# Altium schematic sheet Resolver.SchDoc
size C
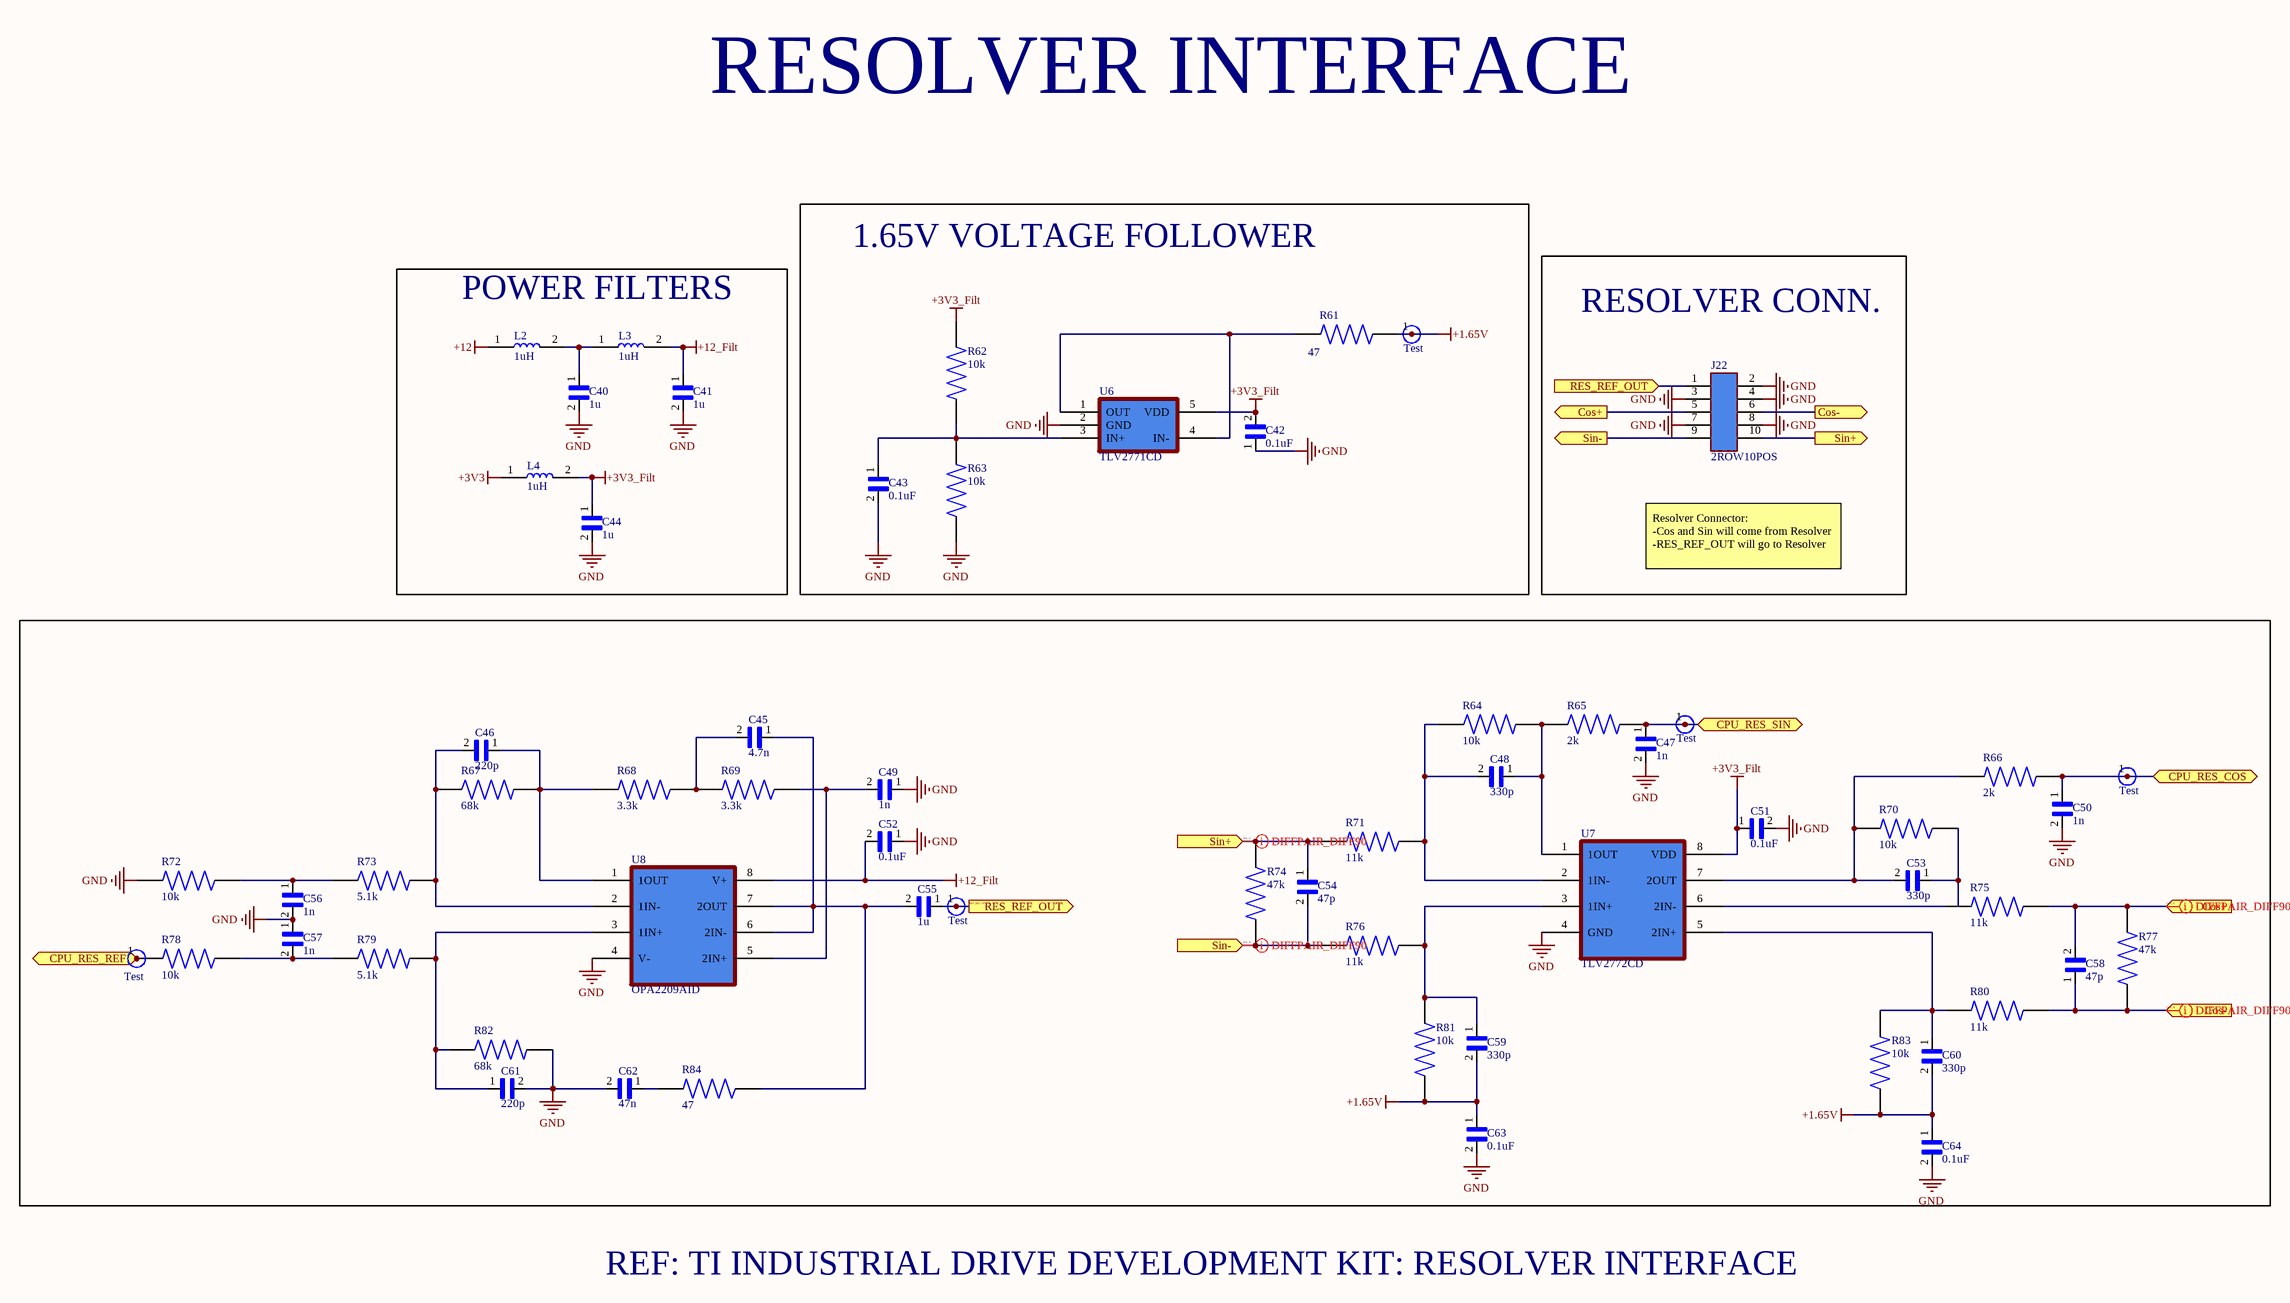
[diagram p0: Resolver.SchDoc]

## Parts
5  Test  [TestPoint]
6  Test  [TestPoint]
7  Test  [TestPoint]
8  Test  [TestPoint]
9  Test  [TestPoint]
C40  1u  [CAP 0805(2012 metric)]
C41  1u  [CAP 0805(2012 metric)]
C42  0.1uF  [CAP 0805(2012 metric)]
C43  0.1uF  [CAP 0805(2012 metric)]
C44  1u  [CAP 0805(2012 metric)]
C45  4.7n  [CAP 0805(2012 metric)]
C46  220p  [CAP 0805(2012 metric)]
C47  1n  [CAP 0805(2012 metric)]
C48  330p  [CAP 0805(2012 metric)]
C49  1n  [CAP 0805(2012 metric)]
C50  1n  [CAP 0805(2012 metric)]
C51  0.1uF  [CAP 0805(2012 metric)]
C52  0.1uF  [CAP 0805(2012 metric)]
C53  330p  [CAP 0805(2012 metric)]
C54  47p  [CAP 0805(2012 metric)]
C55  1u  [CAP 0805(2012 metric)]
C56  1n  [CAP 0805(2012 metric)]
C57  1n  [CAP 0805(2012 metric)]
C58  47p  [CAP 0805(2012 metric)]
C59  330p  [CAP 0805(2012 metric)]
C60  330p  [CAP 0805(2012 metric)]
C61  220p  [CAP 0805(2012 metric)]
C62  47n  [CAP 0805(2012 metric)]
C63  0.1uF  [CAP 0805(2012 metric)]
C64  0.1uF  [CAP 0805(2012 metric)]
J22  2ROW10POS  [2ROW10POS]
L2  1uH  [IND 0805]
L3  1uH  [IND 0805]
L4  1uH  [IND 0805]
R61  47  [RES 0805(2012 metric)]
R62  10k  [RES 0805(2012 metric)]
R63  10k  [RES 0805(2012 metric)]
R64  10k  [RES 0805(2012 metric)]
R65  2k  [RES 0805(2012 metric)]
R66  2k  [RES 0805(2012 metric)]
R67  68k  [RES 0805(2012 metric)]
R68  3.3k  [RES 0805(2012 metric)]
R69  3.3k  [RES 0805(2012 metric)]
R70  10k  [RES 0805(2012 metric)]
R71  11k  [RES 0805(2012 metric)]
R72  10k  [RES 0805(2012 metric)]
R73  5.1k  [RES 0805(2012 metric)]
R74  47k  [RES 0805(2012 metric)]
R75  11k  [RES 0805(2012 metric)]
R76  11k  [RES 0805(2012 metric)]
R77  47k  [RES 0805(2012 metric)]
R78  10k  [RES 0805(2012 metric)]
R79  5.1k  [RES 0805(2012 metric)]
R80  11k  [RES 0805(2012 metric)]
R81  10k  [RES 0805(2012 metric)]
R82  68k  [RES 0805(2012 metric)]
R83  10k  [RES 0805(2012 metric)]
R84  47  [RES 0805(2012 metric)]
U6  TLV2771CD  [TLV2771CD]
U7  TLV2772CD  [TLV2772CD]
U8  OPA2209AID  [OPA2209AID]

## Blocks framed on the sheet
1.65V VOLTAGE FOLLOWER: 5 C42 C43 R61-R63 U6
POWER FILTERS: C40 C41 C44 L2-L4
RESOLVER CONN.: J22

## Ports
Cos+ (in), Cos+ (out), Cos- (in), Cos- (out), CPU_RES_COS (bidir), CPU_RES_REF (bidir), CPU_RES_SIN (bidir), RES_REF_OUT (in), RES_REF_OUT (out), Sin+ (in), Sin+ (out), Sin- (in), Sin- (out)

## Nets
+1.65V: 5.1 C59.2 C60.2 C63.1 C64.1 R61.2 R81.1 R83.1
+3V3: L4.1
+3V3_Filt: C42.2 C44.1 C51.1 L4.2 R62.2 U6.5(VDD) U7.8(VDD)
+12: L2.1
+12_Filt: C41.1 C52.2 L3.2 U8.8(V+)
GND: C40.2 C41.2 C42.1 C43.2 C44.2 C47.2 C49.1 C50.2 C51.2 C52.1 C56.2 C57.1 C61.2 C62.2 C63.2 C64.2 J22.2 J22.3 J22.4 J22.7 J22.8 R63.1 R72.1 R82.1 U6.2(GND) U7.4(GND) U8.4(V-)
COS_N: C58.1 J22.6 R77.2 R80.2 ; port Cos-
COS_P: C58.2 J22.5 R75.2 R77.1 ; port Cos+
CPU_RES_COS: 7.1 C50.1 R66.2 ; port CPU_RES_COS
CPU_RES_REF: 9.1 R78.1 ; port CPU_RES_REF
CPU_RES_SIN: 6.1 C47.1 R65.2 ; port CPU_RES_SIN
RES_REF_OUT: 8.1 C55.1 J22.1 ; port RES_REF_OUT
SIN_N: C54.2 J22.9 R74.1 R76.1 ; port Sin-
SIN_P: C54.1 J22.10 R71.1 R74.2 ; port Sin+
NetC40_1: C40.1 L2.2 L3.1
NetC43_1: C43.1 R62.1 R63.2 U6.3(IN+)
NetC45_1: C45.1 C55.2 R84.2 U8.6(2IN-) U8.7(2OUT)
NetC45_2: C45.2 R68.2 R69.1
NetC46_1: C46.1 R67.2 R68.1 U8.1(1OUT)
NetC46_2: C46.2 R67.1 R73.2 U8.2(1IN-)
NetC48_1: C48.1 R64.2 R65.1 U7.1(1OUT)
NetC48_2: C48.2 R64.1 R71.2 U7.2(1IN-)
NetC49_2: C49.2 R69.2 U8.5(2IN+)
NetC53_1: C53.1 R70.2
NetC53_2: C53.2 R66.1 R70.1 U7.7(2OUT)
NetC56_1: C56.1 R72.2 R73.1
NetC57_2: C57.2 R78.2 R79.1
NetC59_1: C59.1 R76.2 R81.2 U7.3(1IN+)
NetC60_1: C60.1 R80.1 R83.2 U7.5(2IN+)
NetC61_1: C61.1 R79.2 R82.2 U8.3(1IN+)
NetC62_1: C62.1 R84.1
NetR61_1: R61.1 U6.1(OUT) U6.4(IN-)
NetR75_1: R75.1 U7.6(2IN-)

## Layout directives
differential pair; differential pair class DIFF90: COS_N, COS_P, SIN_N, SIN_P

## Notes on the sheet
- RESOLVER INTERFACE
- Resolver Connector:
  -Cos and Sin will come from Resolver
  -RES_REF_OUT will go to Resolver
- REF: TI INDUSTRIAL DRIVE DEVELOPMENT KIT: RESOLVER INTERFACE

## Library data of the parts
5-9 = TestPoint
C40 C41 C44 C55 = 1u 0805
C42 C43 C51 C63 C64 = 0.1uF: 0.1µF ±10% 25V Ceramic Capacitor X7R 0805
C45 = 4.7n 0805
C46 C61 = 220p 0805
C47 C49 C50 C56 C57 = 1n 0805
C48 C53 C59 C60 = 330p 0805
C52 = 0.1uF 25V 0805: 0.1µF ±10% 25V Ceramic Capacitor X7R 0805 (2012Metric)
C54 C58 = 47p 0805
C62 = 47n 0805
L2-L4 = 1uH 0805: 1µH Shielded Multilayer Inductor 1.15A 60mOhm 0805 (2012 Metric)
R61 R84 = 100ohm 0.1W: 100 Ohms ±1% 0.1W, 1/10W Chip Resistor 0805(2012 Metric) Moisture Resistant Thick Film
R62-R64 R70 R72 R78 R81 R83 = 10k 0.1W 0805
R65 R66 = 2k 0805
R67 R82 = 68k 0805
R68 R69 = 3.3k 0805
R71 R75 R76 R80 = 11k 0805
R73 R79 = 5.1k 0805
R74 R77 = 47k 0805
U6 = TLV2771CD: TLV2771IDBVR
U7 = TLV2772CD: tlv2772cdR